# EAGLE design HighPowerWS2801_v2_smd (EAGLE 8.3.2)
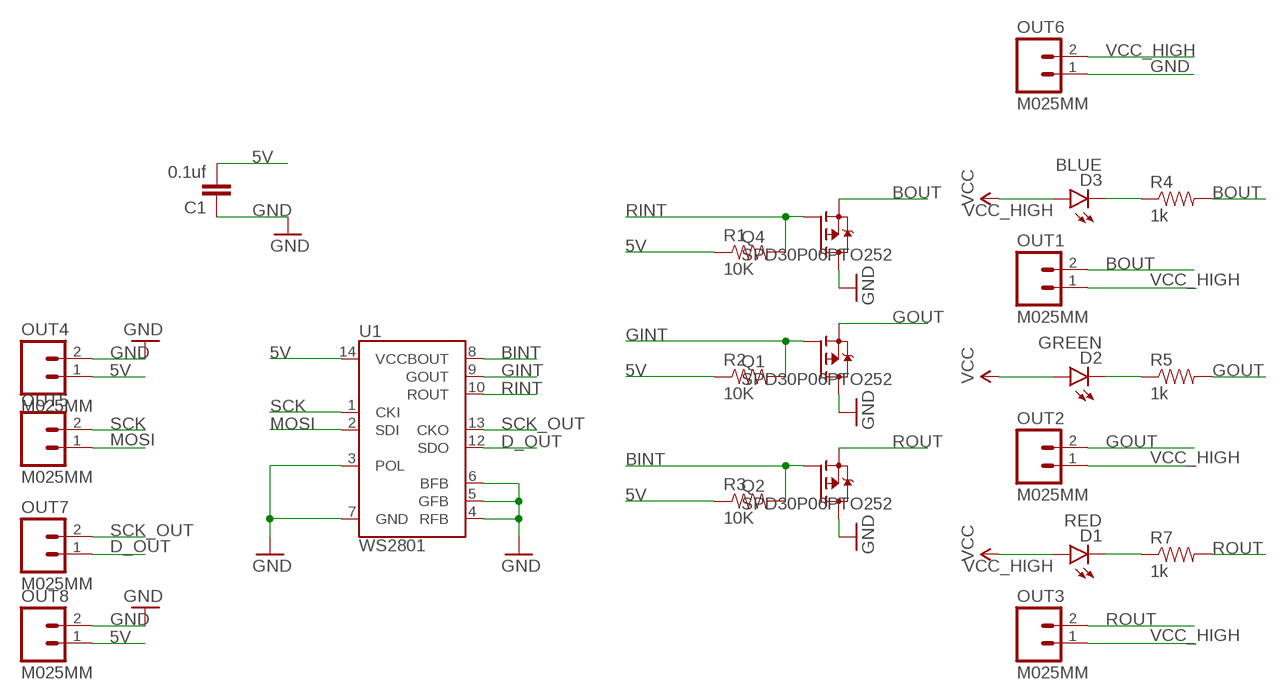
[diagram p0: schematic, sheet 1]

## Parts
C1  0.1uf  CAP0603-CAP  [0603-CAP]
D1  RED  LED-RED0603  [LED-0603]
D2  GREEN  LED-GREEN0603  [LED-0603]
D3  BLUE  LED-BLUE0603  [LED-0603]
OUT1  M025MM  [SCREWTERMINAL-5MM-2]
OUT2  M025MM  [SCREWTERMINAL-5MM-2]
OUT3  M025MM  [SCREWTERMINAL-5MM-2]
OUT4  M025MM  [SCREWTERMINAL-5MM-2]
OUT5  M025MM  [SCREWTERMINAL-5MM-2]
OUT6  M025MM  [SCREWTERMINAL-5MM-2]
OUT7  M025MM  [SCREWTERMINAL-5MM-2]
OUT8  M025MM  [SCREWTERMINAL-5MM-2]
Q1  SPD30P06PTO252  [TO252]
Q2  SPD30P06PTO252  [TO252]
Q4  SPD30P06PTO252  [TO252]
R1  10K  RESISTOR0603  [0603-RES]
R2  10K  RESISTOR0603  [0603-RES]
R3  10K  RESISTOR0603  [0603-RES]
R4  1k  RESISTOR0603  [0603-RES]
R5  1k  RESISTOR0603  [0603-RES]
R7  1k  RESISTOR0603  [0603-RES]
U1  WS2801  [SOP-14]

## Nets
5V: C1.2 OUT4.1 OUT8.1 R1.1 R2.1 R3.1 U1.14(VCC)
BINT: Q2.1(G) R3.2 U1.8(BOUT)
BOUT: OUT1.2 Q4.2(S) R4.2
D_OUT: OUT7.1 U1.12(SDO)
GINT: Q1.1(G) R2.2 U1.9(GOUT)
GND: C1.1 OUT4.2 OUT6.1 OUT8.2 Q1.3(D) Q2.3(D) Q4.3(D) U1.3(POL) U1.4(RFB) U1.5(GFB) U1.6(BFB) U1.7(GND)
GOUT: OUT2.2 Q1.2(S) R5.2
MOSI: OUT5.1 U1.2(SDI)
N$1: D3.C R4.1
N$2: D2.C R5.1
N$6: D1.C R7.1
RINT: Q4.1(G) R1.2 U1.10(ROUT)
ROUT: OUT3.2 Q2.2(S) R7.2
SCK: OUT5.2 U1.1(CKI)
SCK_OUT: OUT7.2 U1.13(CKO)
VCC_HIGH: D1.A D2.A D3.A OUT1.1 OUT2.1 OUT3.1 OUT6.2 ; supply symbol labelled VCC

## Library data of the parts
C1 = SparkFun-Capacitors:CAP: Capacitor Standard 0603 ceramic capacitor, and 0.1" leaded capacitor.
D1 = SparkFun-LED:LED-RED: Assorted Red LEDs LilyPad 1206- DIO-09912 1206- DIO-00809 0603- DIO-00819 "SMART" means more efficient and expensive; PROD_ID: DIO-00819
D2 = SparkFun-LED:LED-GREEN: Various green LEDs Green LEDs used in SFE Production 0603- DIO-00821 LARGE- DIO-00862 LILYPAD- DIO-09910; PROD_ID: DIO-00821
D3 = SparkFun-LED:LED-BLUE: Blue LEDs for production use Various blue LEDs stocked by SparkFun production 0603 - DIO-08575 Rebel - DIO-09553 1206 - DIO-09911; PROD_ID: DIO-08575
OUT1-OUT8 = SparkFun-Connectors:M02: Standard 2-pin 0.1" header. Use with - straight break away headers ( PRT-00116) - right angle break away headers (PRT-00553) - swiss pins (PRT-00743) - machine pins (PRT-00117) - female headers (PRT-00115) Molex polarized connector foot print use with: PRT-08233 with associated crimp pins and housings. 2.54_SCREWTERM for use with PRT-10571. 3.5mm Screw Terminal footprints for PRT-08084 5mm Screw Terminal footprints for use with PRT-08433
Q1 Q2 Q4 = transistor-fet:SPD30P06P: SIPMOS(R) Power-Transistor P-Channel, Enhancement mode Source: http://www.infineon.com/upload/Document/cmc_upload/documents/012/3615/SPD_U30P06P.pdf
R1-R5 R7 = SparkFun-Resistors:RESISTOR: Resistor Basic schematic elements and footprints for 0603, 1206, and PTH resistors.
U1 = SparkFun-DigitalIC:WS2801: WS2801 3 Channel Constant Current LED Driver with programmable PWM outputs. Datasheet: http://www.sparkfun.com/datasheets/Components/LED/WS2801.pdf

## Board
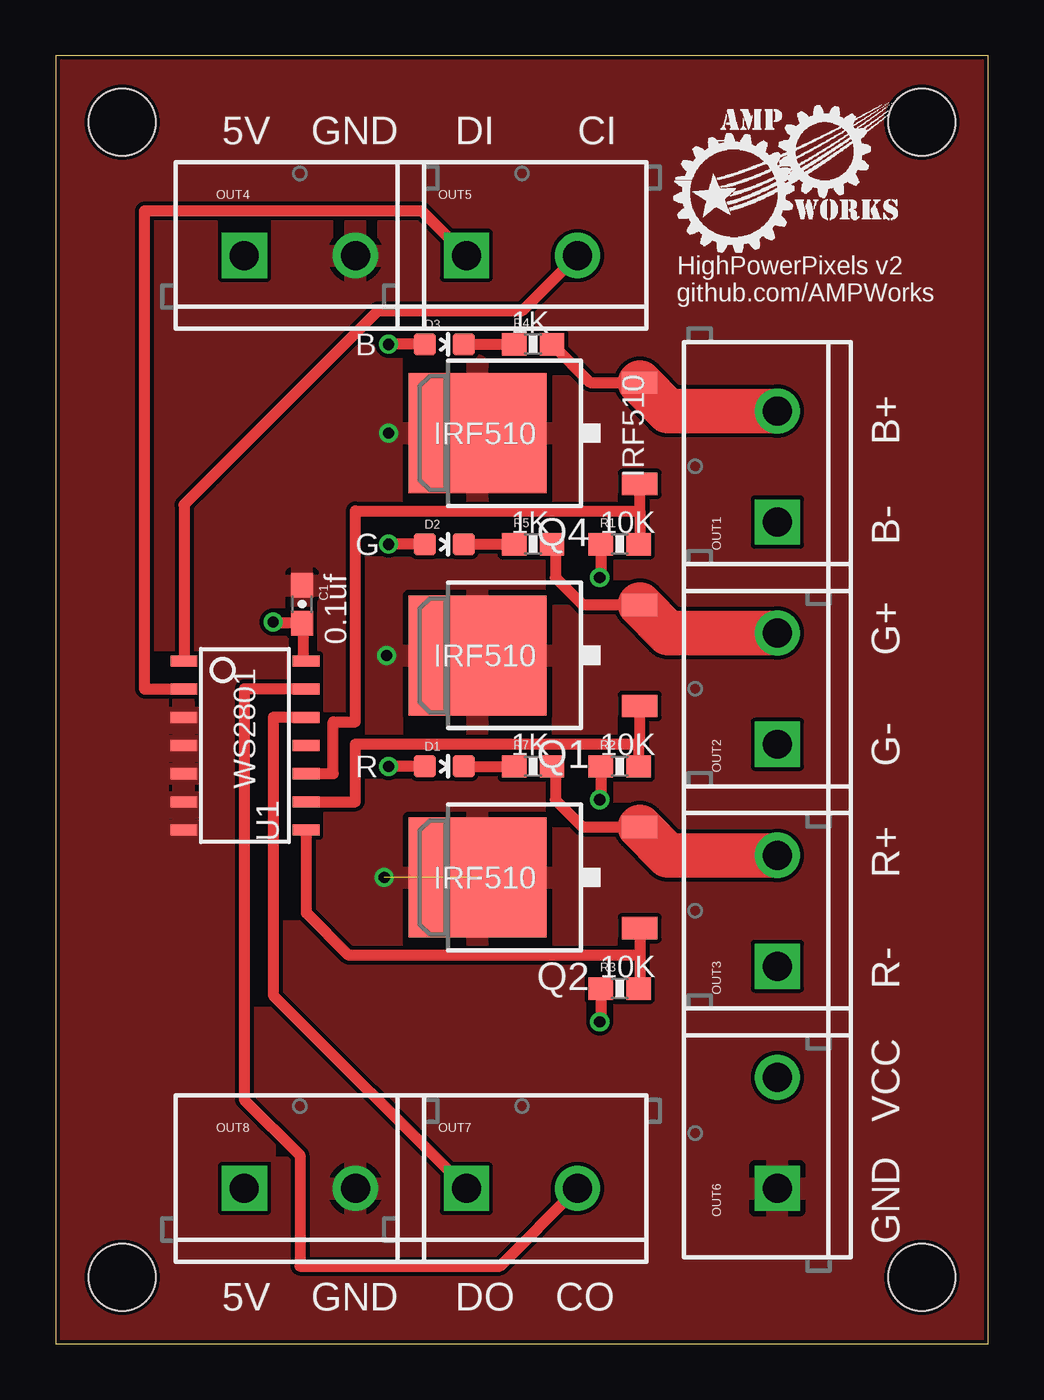
[diagram p1: board, top side]
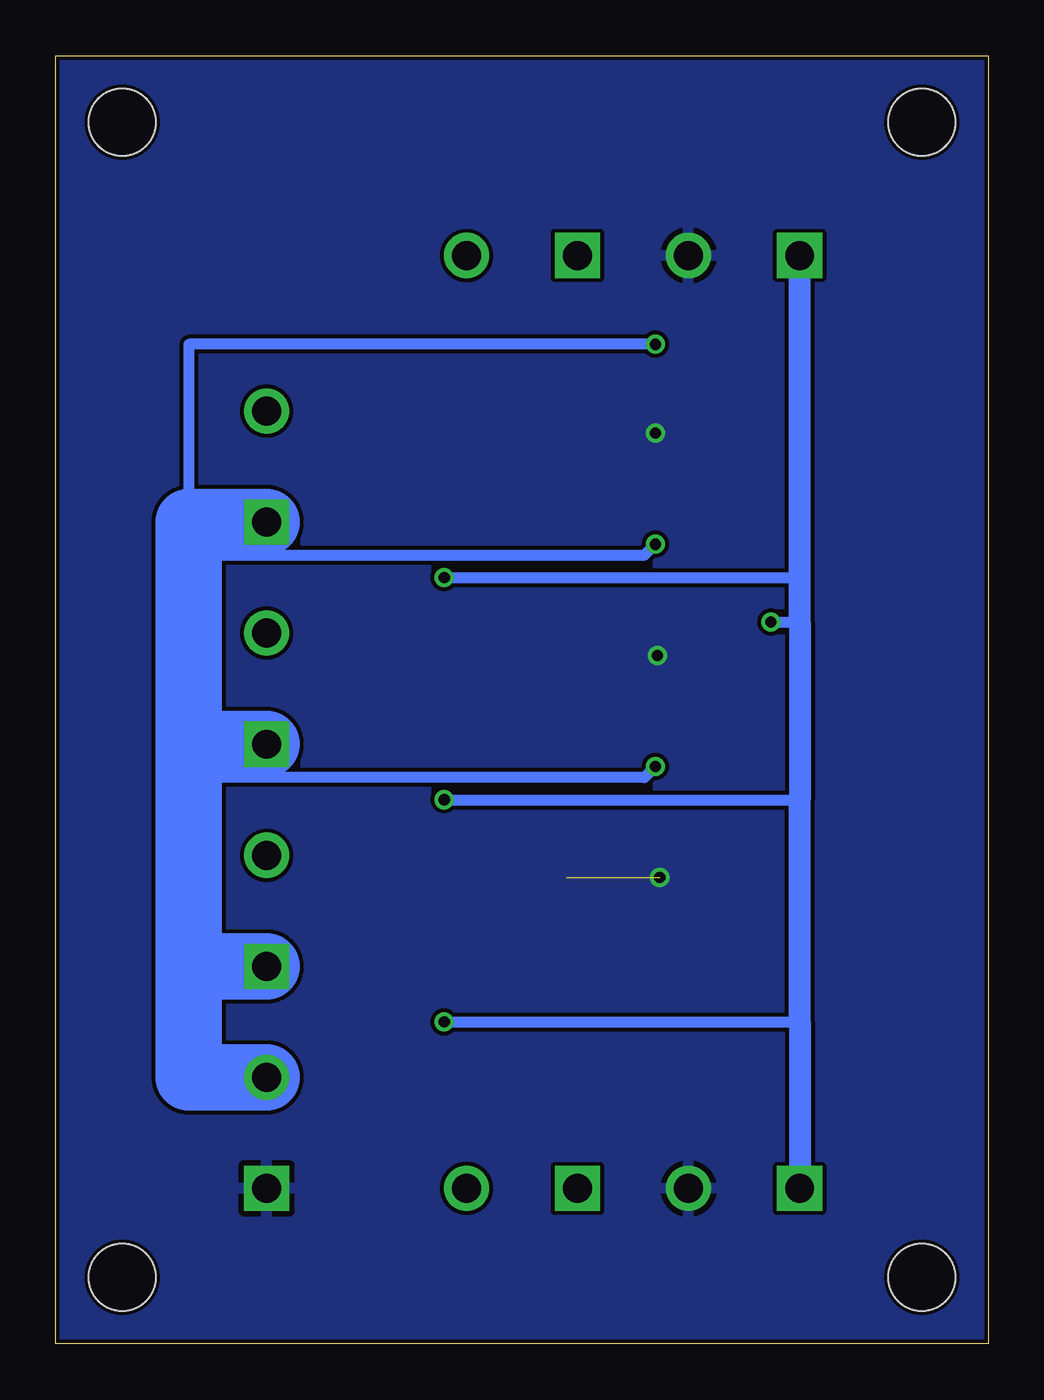
[diagram p2: board, bottom side, seen from below]

Size 42 x 58 mm. Coordinates in mm from the lower left corner, seen from the top.
Outline: 0,0 42,0 42,58 0,58 0,0
Copper layers (1*16): Top 0.035mm / dielectric 1.5mm / Bottom 0.035mm
Design rules "SparkFun-2-layer-TIGHT": minimum track width 7mil, minimum drill 15mil, track to track 7mil, track to pad 7mil, pad to pad 7mil, via to via 7mil, smd to smd 7mil, copper to edge 7mil, drill to drill 7mil, minimum pad ring 7mil, minimum via ring 7mil, stop-mask expansion 4mil, vias tented up to drill 25mil, thermal gap 10mil
Holes 3 mm at 3,3 3,55 39,55 39,3

### Footprints (pad centres in the part's own frame; a part is rotated, then mirrored left to right if it is on the bottom)
0603-CAP = smd 1.1 x 1: 1 -0.85,0; 2 0.85,0
LED-0603 = smd 1 x 1: A 0,-0.877; C 0,0.877
SCREWTERMINAL-5MM-2 = drill 1.3 pad 2.032 square: 1 0,0 | drill 1.3 pad 2.032: 2 5,0
TO252 = smd 1 x 1.6: 1 -2.28,-4.8; 2 2.28,-4.8 | smd 5.4 x 6.2: 3 0,2.5
0603-RES = smd 1.1 x 1: 1 -0.85,0; 2 0.85,0
SOP-14 = smd 0.5 x 1.2: 1 -3.81,-2.75; 2 -2.54,-2.75; 3 -1.27,-2.75; 4 0,-2.75; 5 1.27,-2.75; 6 2.54,-2.75; 7 3.81,-2.75; 8 3.81,2.75; 9 2.54,2.75; 10 1.27,2.75; 11 0,2.75; 12 -1.27,2.75; 13 -2.54,2.75; 14 -3.81,2.75

### Placement (x,y rotation side)
C1  11.1,33.3 270 top
D1  17.5,26 270 top
D2  17.5,36 270 top
D3  17.5,45 270 top
OUT1  32.5,37 90 top
OUT2  32.5,27 90 top
OUT3  32.5,17 90 top
OUT4  8.5,49 0 top
OUT5  18.5,49 0 top
OUT6  32.5,7 90 top
OUT7  18.5,7 0 top
OUT8  8.5,7 0 top
Q1  21.5,31 90 top
Q2  21.5,21 90 top
Q4  21.5,41 90 top
R1  25.4,36 0 top
R2  25.4,26 0 top
R3  25.4,16 0 top
R4  21.5,45 0 top
R5  21.5,36 0 top
R7  21.5,26 0 top
U1  8.53,26.94 270 top

### Tracks (layer width: path | path; a pad name or v marks a point on that pad's centre or on a via)
5V  (via drill 0.5)
  Top 0.5: R1.1 24.55,34.5 v24.5,34.5 | R2.1 24.55,24.5 v24.5,24.5 | R3.1 24.55,14.5 v24.5,14.5 | U1.14 11.15,30.88 11.15,32.45 C1.2 9.8,32.45 v9.8,32.5
  Bottom 0.5: v24.5,34.5 8.5,34.5 | v24.5,24.5 8.5,24.5 | v24.5,14.5 8.5,14.5 | v9.8,32.5 8.5,32.5
  Bottom 1: OUT8.1 8.5,14.5 8.5,24.5 8.5,32.5 8.5,34.5 OUT4.1
BINT
  Top 0.5: Q2.1 26.3,17.5 | 26.3,17.5 26.3,16 R3.2 | 26.3,17.5 13.2,17.5 11.3,19.4 11.3,23.11 U1.8
BOUT
  Top 0.5: R4.2 24.07,43.28 Q4.2
  Top 2: OUT1.2 27.58,42 Q4.2
D_OUT
  Top 0.5: U1.12 9.81,28.21 9.8,28.2 9.8,15.7 OUT7.1
GINT
  Top 0.5: U1.9 13.5,24.4 13.5,27 26.3,27 | 26.3,27 Q1.1 | 26.3,27 26.25,27 R2.2
GND  (via drill 0.5)  (1 unrouted)
  other vias: 15,41 14.9,31 14.8,21
  pour Top: 0,0 42,0 42,58 0,58
  pour Bottom: 0,0 42,0 42,58 0,58
GOUT
  Top 0.5: R5.2 22.5,35.85 22.5,34.5 23.72,33.28 Q1.2
  Top 2: OUT2.2 27.58,32 Q1.2
MOSI
  Top 0.5: OUT5.1 16.5,51 4,51 4,29.5 4.02,29.48 U1.2
N$1
  Top 0.5: D3.C R4.1
N$2
  Top 0.5: D2.C R5.1
N$6
  Top 0.5: D1.C R7.1
RINT
  Top 0.5: R1.2 26.3,36 26.3,37.5 | 26.3,37.5 Q4.1 | U1.10 12.5,25.67 12.5,28 13.5,28 13.5,37.5 26.3,37.5
ROUT
  Top 0.5: R7.2 22.5,25.85 22.5,24.5 23.72,23.28 Q2.2
  Top 2: OUT3.2 27.58,22 Q2.2
SCK
  Top 0.5: OUT5.2 21,46.5 14.5,46.5 5.78,37.78 U1.1
SCK_OUT
  Top 0.5: U1.13 8.52,29.48 8.5,29.5 8.5,11 11,8.5 11,3.5 20,3.5 OUT7.2
VCC_HIGH  (via drill 0.5)
  Top 0.5: D3.A v15,45 | D2.A v15,36 | D1.A v15,25.99
  Bottom 0.5: 35,16 36,17 | 33,26.07 33,26 36,26 36,27 | 36,36 36,37 36,45 v15,45 | v15,36 15.5,35.5 36,35.5 | v15,25.99 15.49,25.5 36,25.5
  Bottom 3: OUT6.2 36,12 36,17 | 36,27 36,25.5 36,17 | 36,27 36,35.5 36,37 OUT1.1 | OUT2.1 36,27 | OUT3.1 36,17

### Text on the board
tPlace: HighPowerPixels v2 | github.com/AMPWorks
tNames: 5V | GND | DI | CI | 1K | B | IRF510 | B+ | IRF510 | G | 1K | 10K | B- | 0.1uf | G+ | IRF510 | R | 1K | 10K | G- | WS2801 | R+ | IRF510 | 10K | R- | VCC | GND | 5V | GND | DO | CO